# Altium schematic sheet FIT_PM12-main1.SchDoc: FIT_PM12 board
size 420 x 297 mm; CheckedBy: G.Kasprowicz; Author: INR Moscow; CompanyName: WUT ISE; DrawnBy: M.Podgórski; Organization: WUT ISE; Address1: PW ISE; Address2: Nowowiejska 15/19 00-665 Warsaw; Address3: gkasprow@gmail.com; DocumentNumber: 1; Revision: 2; SheetNumber: 1; SheetTotal: 34; ModifiedBy: -; CheckedDate: -; Title2: TOP; DivGrp: WUT ISE; Designer: INR RAS; ModifiedDate: -; ProjectName: Sensor Box
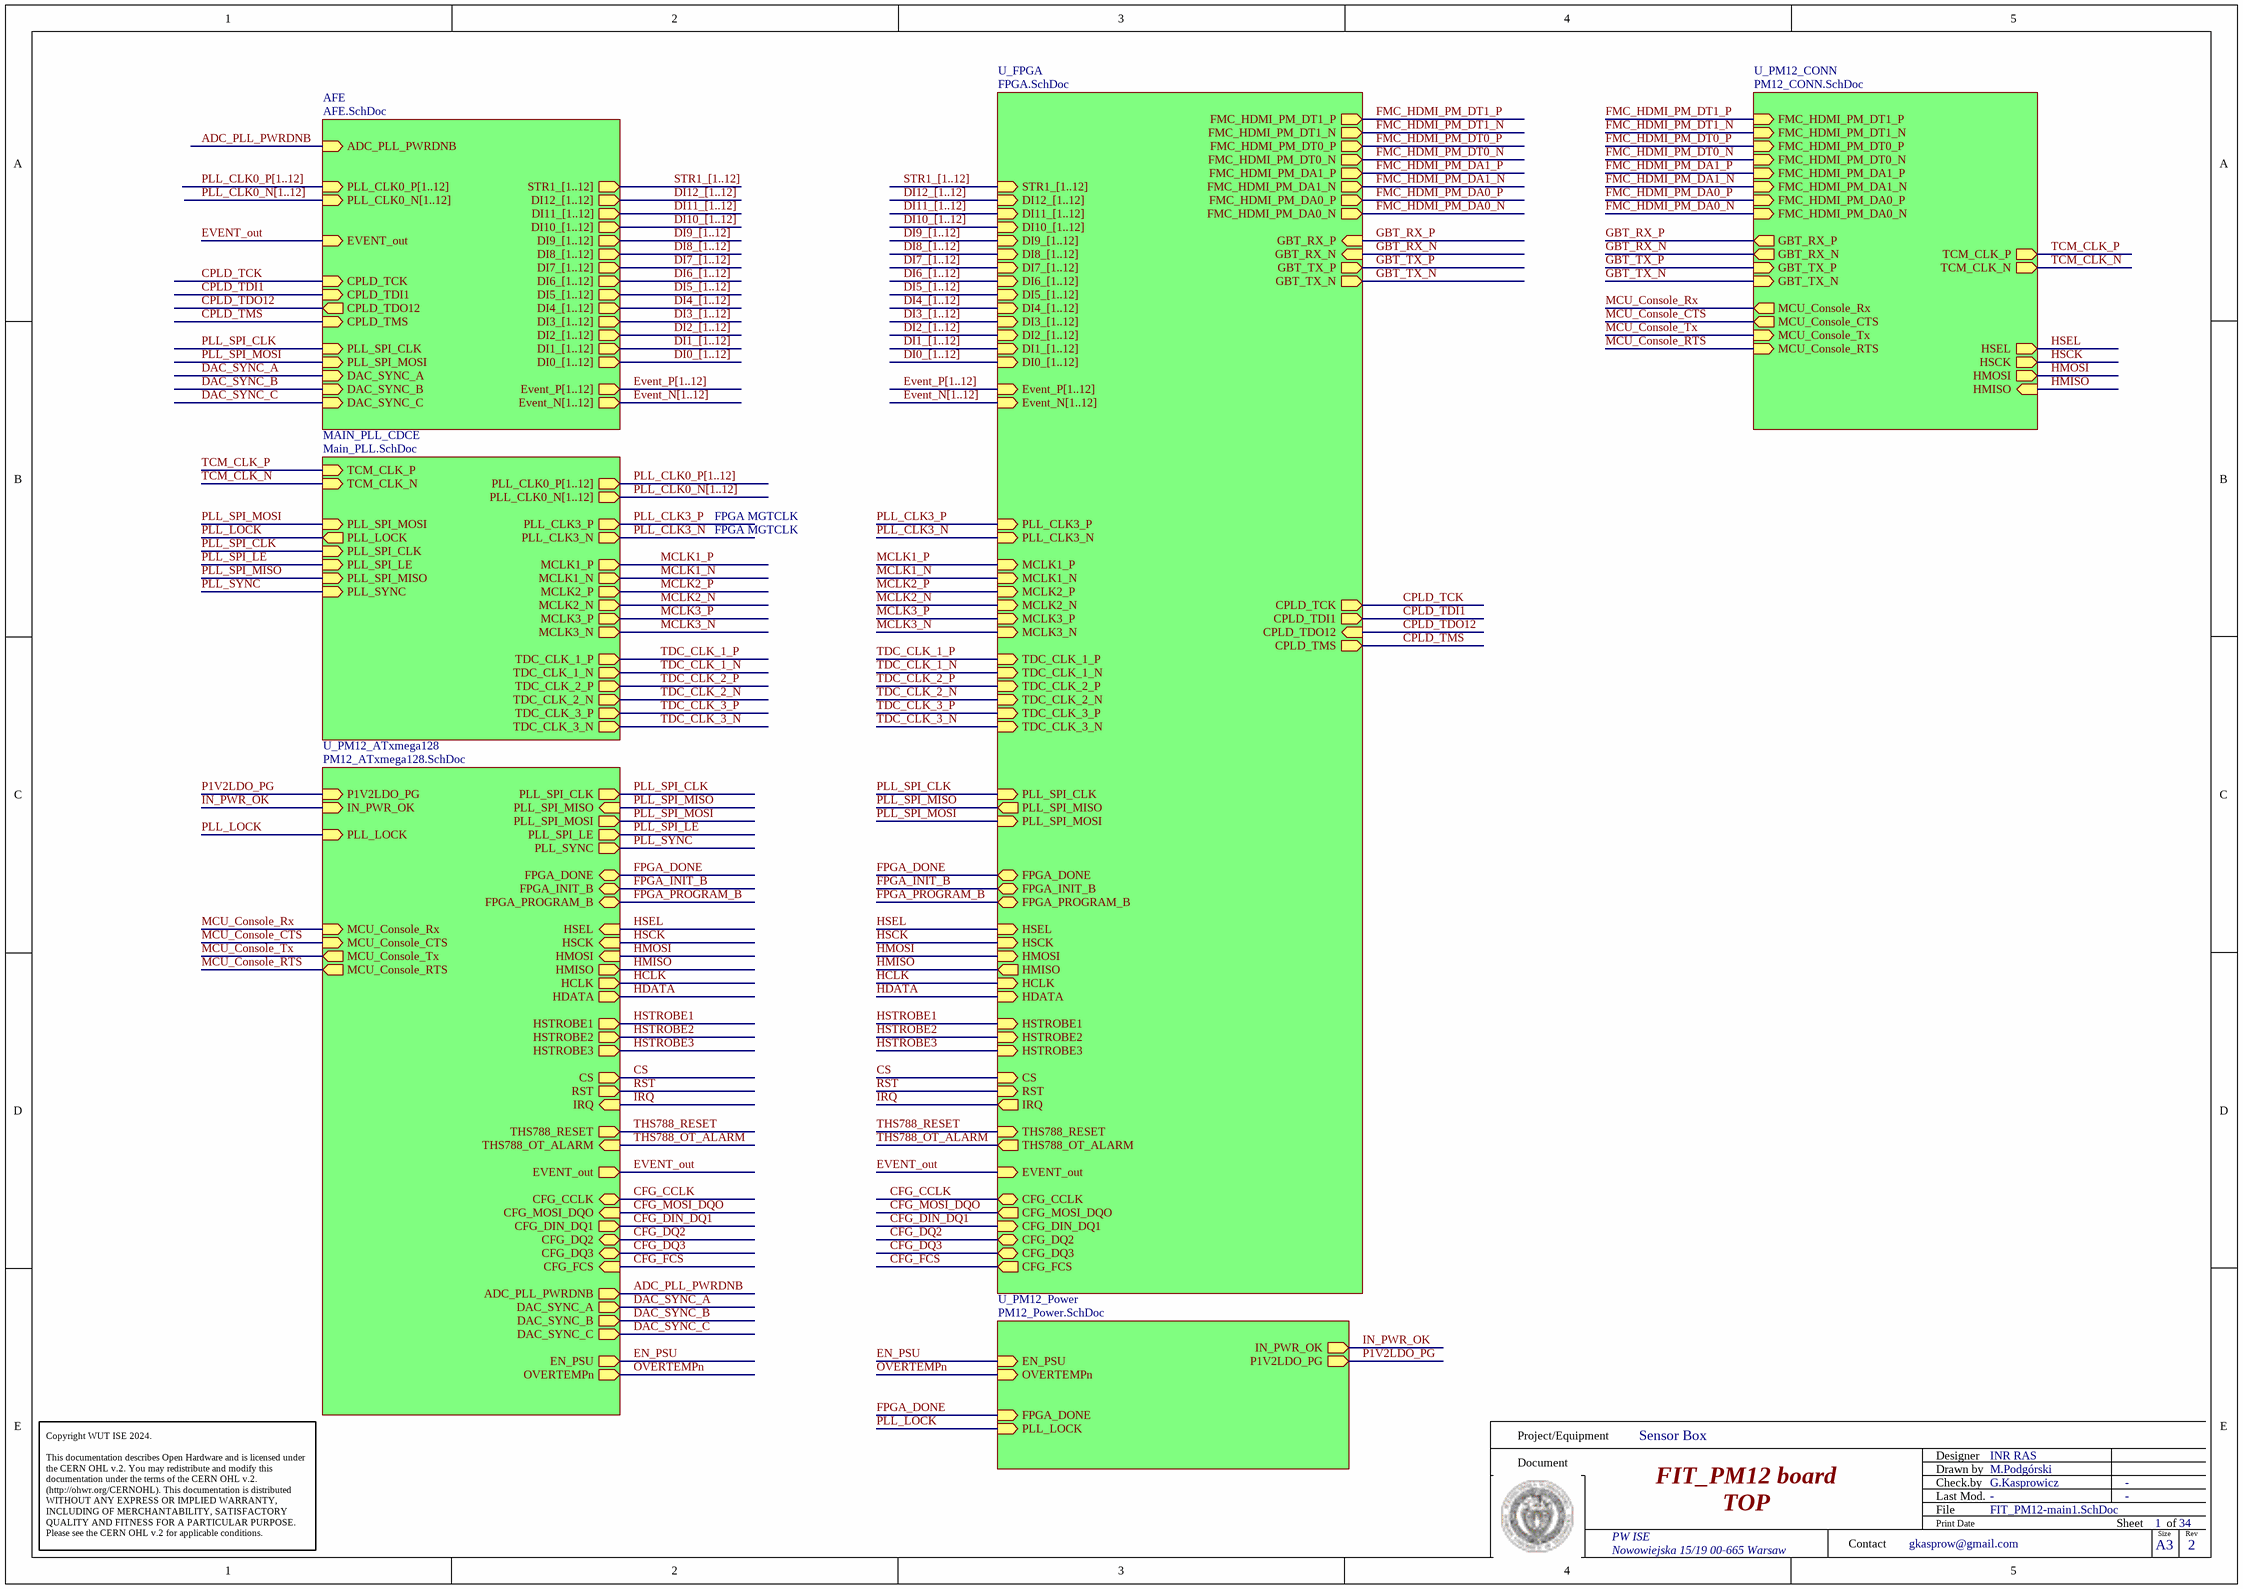
[diagram p0: FIT_PM12-main1.SchDoc]

## Sub-sheets
AFE = AFE.SchDoc: CPLD_TCK (in), CPLD_TMS (in), CPLD_TDI1 (in), CPLD_TDO12 (out), PLL_SPI_MOSI (in), DAC_SYNC_A (in), DAC_SYNC_B (in), DAC_SYNC_C (in), ADC_PLL_PWRDNB (in), EVENT_out (in), Event_P[1..12] (out), Event_N[1..12] (out), PLL_CLK0_P[1..12] (in), PLL_CLK0_N[1..12] (in), PLL_SPI_CLK (in), STR1_[1..12] (out), DI12_[1..12] (out), DI11_[1..12] (out), DI10_[1..12] (out), DI9_[1..12] (out), DI8_[1..12] (out), DI7_[1..12] (out), DI6_[1..12] (out), DI5_[1..12] (out), DI4_[1..12] (out), DI3_[1..12] (out), DI2_[1..12] (out), DI1_[1..12] (out), DI0_[1..12] (out)
MAIN_PLL_CDCE = Main_PLL.SchDoc: PLL_SPI_CLK (in), PLL_SPI_MISO (in), TCM_CLK_P (in), TCM_CLK_N (in), PLL_SYNC (in), PLL_LOCK (out), PLL_SPI_LE (in), PLL_SPI_MOSI (in), PLL_CLK3_P (out), PLL_CLK3_N (out), PLL_CLK0_P[1..12] (out), PLL_CLK0_N[1..12] (out), TDC_CLK_1_P (out), TDC_CLK_1_N (out), TDC_CLK_2_P (out), TDC_CLK_2_N (out), TDC_CLK_3_P (out), TDC_CLK_3_N (out), MCLK1_P (out), MCLK1_N (out), MCLK2_P (out), MCLK2_N (out), MCLK3_P (out), MCLK3_N (out)
U_FPGA = FPGA.SchDoc: FMC_HDMI_PM_DT1_P (out), FMC_HDMI_PM_DT1_N (out), FMC_HDMI_PM_DT0_P (out), FMC_HDMI_PM_DT0_N (out), FMC_HDMI_PM_DA1_P (out), FMC_HDMI_PM_DA1_N (out), FMC_HDMI_PM_DA0_P (out), FMC_HDMI_PM_DA0_N (out), HCLK (in), HDATA (in), HSTROBE3 (in), TDC_CLK_3_P (in), TDC_CLK_3_N (in), MCLK3_P (in), MCLK3_N (in), THS788_OT_ALARM (out), THS788_RESET (in), TDC_CLK_1_P (in), TDC_CLK_1_N (in), MCLK1_P (in), MCLK1_N (in), TDC_CLK_2_P (in), TDC_CLK_2_N (in), MCLK2_P (in), MCLK2_N (in), STR1_[1..12] (in), DI12_[1..12] (in), DI11_[1..12] (in), DI10_[1..12] (in), DI9_[1..12] (in), DI8_[1..12] (in), DI7_[1..12] (in), DI6_[1..12] (in), DI5_[1..12] (in), DI4_[1..12] (in), DI3_[1..12] (in), DI2_[1..12] (in), DI1_[1..12] (in), DI0_[1..12] (in), Event_P[1..12] (in), Event_N[1..12] (in), PLL_SPI_MOSI (in), PLL_SPI_CLK (in), PLL_SPI_MISO (out), CFG_MOSI_DQO (out), CFG_DIN_DQ1 (in), CFG_DQ2 (bidir), CFG_DQ3 (bidir), CFG_FCS (out), EVENT_out (in), HSEL (in), HSCK (in), HMOSI (in), HMISO (out), RST (in), CS (in), IRQ (out), PLL_CLK3_P (in), PLL_CLK3_N (in), GBT_RX_P (in), GBT_RX_N (in), GBT_TX_P (out), GBT_TX_N (out), CFG_CCLK (bidir), CPLD_TDO12 (in), FPGA_DONE (bidir), FPGA_INIT_B (bidir), FPGA_PROGRAM_B (bidir), CPLD_TCK (out), CPLD_TDI1 (out), CPLD_TMS (out), HSTROBE2 (in), HSTROBE1 (in)
U_PM12_ATxmega128 = PM12_ATxmega128.SchDoc: ADC_PLL_PWRDNB (out), PLL_SPI_MOSI (out), CFG_MOSI_DQO (in), CFG_DIN_DQ1 (out), CFG_DQ2 (bidir), CFG_DQ3 (bidir), CFG_FCS (in), CFG_CCLK (bidir), FPGA_DONE (bidir), FPGA_INIT_B (bidir), PLL_SPI_CLK (out), EVENT_out (out), PLL_SPI_MISO (in), CS (out), IRQ (in), RST (out), FPGA_PROGRAM_B (bidir), PLL_SYNC (out), PLL_LOCK (in), PLL_SPI_LE (out), IN_PWR_OK (in), MCU_Console_Rx (in), MCU_Console_CTS (in), MCU_Console_Tx (out), MCU_Console_RTS (out), EN_PSU (out), P1V2LDO_PG (in), THS788_RESET (out), THS788_OT_ALARM (in), OVERTEMPn (out), HSCK (in), HMISO (out), HSEL (in), HMOSI (in), HCLK (out), HDATA (out), HSTROBE1 (out), HSTROBE2 (out), HSTROBE3 (out), DAC_SYNC_A (out), DAC_SYNC_B (out), DAC_SYNC_C (out)
U_PM12_CONN = PM12_CONN.SchDoc: GBT_TX_P (in), GBT_TX_N (in), GBT_RX_P (out), GBT_RX_N (out), TCM_CLK_P (out), TCM_CLK_N (out), MCU_Console_Rx (out), MCU_Console_CTS (out), MCU_Console_Tx (in), MCU_Console_RTS (in), FMC_HDMI_PM_DT1_P (in), FMC_HDMI_PM_DT1_N (in), FMC_HDMI_PM_DT0_P (in), FMC_HDMI_PM_DT0_N (in), FMC_HDMI_PM_DA1_P (in), FMC_HDMI_PM_DA1_N (in), FMC_HDMI_PM_DA0_P (in), FMC_HDMI_PM_DA0_N (in), HSCK (out), HMISO (in), HSEL (out), HMOSI (out)
U_PM12_Power = PM12_Power.SchDoc: IN_PWR_OK (out), P1V2LDO_PG (out), EN_PSU (in), FPGA_DONE (in), OVERTEMPn (in), PLL_LOCK (in)

## Nets
ADC_PLL_PWRDNB: sheet U_PM12_ATxmega128/ADC_PLL_PWRDNB, sheet AFE/ADC_PLL_PWRDNB
CFG_CCLK: sheet U_PM12_ATxmega128/CFG_CCLK, sheet U_FPGA/CFG_CCLK
CFG_DIN_DQ1: sheet U_PM12_ATxmega128/CFG_DIN_DQ1, sheet U_FPGA/CFG_DIN_DQ1
CFG_DQ2: sheet U_PM12_ATxmega128/CFG_DQ2, sheet U_FPGA/CFG_DQ2
CFG_DQ3: sheet U_PM12_ATxmega128/CFG_DQ3, sheet U_FPGA/CFG_DQ3
CFG_FCS: sheet U_PM12_ATxmega128/CFG_FCS, sheet U_FPGA/CFG_FCS
CFG_MOSI_DQO: sheet U_PM12_ATxmega128/CFG_MOSI_DQO, sheet U_FPGA/CFG_MOSI_DQO
CPLD_TCK: sheet U_FPGA/CPLD_TCK, sheet AFE/CPLD_TCK
CPLD_TDI1: sheet U_FPGA/CPLD_TDI1, sheet AFE/CPLD_TDI1
CPLD_TDO12: sheet U_FPGA/CPLD_TDO12, sheet AFE/CPLD_TDO12
CPLD_TMS: sheet U_FPGA/CPLD_TMS, sheet AFE/CPLD_TMS
CS: sheet U_PM12_ATxmega128/CS, sheet U_FPGA/CS
DAC_SYNC_A: sheet U_PM12_ATxmega128/DAC_SYNC_A, sheet AFE/DAC_SYNC_A
DAC_SYNC_B: sheet U_PM12_ATxmega128/DAC_SYNC_B, sheet AFE/DAC_SYNC_B
DAC_SYNC_C: sheet U_PM12_ATxmega128/DAC_SYNC_C, sheet AFE/DAC_SYNC_C
EN_PSU: sheet U_PM12_ATxmega128/EN_PSU, sheet U_PM12_Power/EN_PSU
EVENT_out: sheet U_PM12_ATxmega128/EVENT_out, sheet U_FPGA/EVENT_out, sheet AFE/EVENT_out
FMC_HDMI_PM_DA0_N: sheet U_PM12_CONN/FMC_HDMI_PM_DA0_N, sheet U_FPGA/FMC_HDMI_PM_DA0_N
FMC_HDMI_PM_DA0_P: sheet U_PM12_CONN/FMC_HDMI_PM_DA0_P, sheet U_FPGA/FMC_HDMI_PM_DA0_P
FMC_HDMI_PM_DA1_N: sheet U_PM12_CONN/FMC_HDMI_PM_DA1_N, sheet U_FPGA/FMC_HDMI_PM_DA1_N
FMC_HDMI_PM_DA1_P: sheet U_PM12_CONN/FMC_HDMI_PM_DA1_P, sheet U_FPGA/FMC_HDMI_PM_DA1_P
FMC_HDMI_PM_DT0_N: sheet U_PM12_CONN/FMC_HDMI_PM_DT0_N, sheet U_FPGA/FMC_HDMI_PM_DT0_N
FMC_HDMI_PM_DT0_P: sheet U_PM12_CONN/FMC_HDMI_PM_DT0_P, sheet U_FPGA/FMC_HDMI_PM_DT0_P
FMC_HDMI_PM_DT1_N: sheet U_PM12_CONN/FMC_HDMI_PM_DT1_N, sheet U_FPGA/FMC_HDMI_PM_DT1_N
FMC_HDMI_PM_DT1_P: sheet U_PM12_CONN/FMC_HDMI_PM_DT1_P, sheet U_FPGA/FMC_HDMI_PM_DT1_P
FPGA_DONE: sheet U_PM12_ATxmega128/FPGA_DONE, sheet U_PM12_Power/FPGA_DONE, sheet U_FPGA/FPGA_DONE
FPGA_INIT_B: sheet U_PM12_ATxmega128/FPGA_INIT_B, sheet U_FPGA/FPGA_INIT_B
FPGA_PROGRAM_B: sheet U_PM12_ATxmega128/FPGA_PROGRAM_B, sheet U_FPGA/FPGA_PROGRAM_B
GBT_RX_N: sheet U_PM12_CONN/GBT_RX_N, sheet U_FPGA/GBT_RX_N
GBT_RX_P: sheet U_PM12_CONN/GBT_RX_P, sheet U_FPGA/GBT_RX_P
GBT_TX_N: sheet U_PM12_CONN/GBT_TX_N, sheet U_FPGA/GBT_TX_N
GBT_TX_P: sheet U_PM12_CONN/GBT_TX_P, sheet U_FPGA/GBT_TX_P
HCLK: sheet U_PM12_ATxmega128/HCLK, sheet U_FPGA/HCLK
HDATA: sheet U_PM12_ATxmega128/HDATA, sheet U_FPGA/HDATA
HMISO: sheet U_PM12_CONN/HMISO, sheet U_PM12_ATxmega128/HMISO, sheet U_FPGA/HMISO
HMOSI: sheet U_PM12_CONN/HMOSI, sheet U_PM12_ATxmega128/HMOSI, sheet U_FPGA/HMOSI
HSCK: sheet U_PM12_CONN/HSCK, sheet U_PM12_ATxmega128/HSCK, sheet U_FPGA/HSCK
HSEL: sheet U_PM12_CONN/HSEL, sheet U_PM12_ATxmega128/HSEL, sheet U_FPGA/HSEL
HSTROBE1: sheet U_PM12_ATxmega128/HSTROBE1, sheet U_FPGA/HSTROBE1
HSTROBE2: sheet U_PM12_ATxmega128/HSTROBE2, sheet U_FPGA/HSTROBE2
HSTROBE3: sheet U_PM12_ATxmega128/HSTROBE3, sheet U_FPGA/HSTROBE3
IN_PWR_OK: sheet U_PM12_ATxmega128/IN_PWR_OK, sheet U_PM12_Power/IN_PWR_OK
IRQ: sheet U_PM12_ATxmega128/IRQ, sheet U_FPGA/IRQ
MCLK1_N: sheet MAIN_PLL_CDCE/MCLK1_N, sheet U_FPGA/MCLK1_N
MCLK1_P: sheet MAIN_PLL_CDCE/MCLK1_P, sheet U_FPGA/MCLK1_P
MCLK2_N: sheet MAIN_PLL_CDCE/MCLK2_N, sheet U_FPGA/MCLK2_N
MCLK2_P: sheet MAIN_PLL_CDCE/MCLK2_P, sheet U_FPGA/MCLK2_P
MCLK3_N: sheet MAIN_PLL_CDCE/MCLK3_N, sheet U_FPGA/MCLK3_N
MCLK3_P: sheet MAIN_PLL_CDCE/MCLK3_P, sheet U_FPGA/MCLK3_P
MCU_Console_CTS: sheet U_PM12_CONN/MCU_Console_CTS, sheet U_PM12_ATxmega128/MCU_Console_CTS
MCU_Console_RTS: sheet U_PM12_CONN/MCU_Console_RTS, sheet U_PM12_ATxmega128/MCU_Console_RTS
MCU_Console_Rx: sheet U_PM12_CONN/MCU_Console_Rx, sheet U_PM12_ATxmega128/MCU_Console_Rx
MCU_Console_Tx: sheet U_PM12_CONN/MCU_Console_Tx, sheet U_PM12_ATxmega128/MCU_Console_Tx
OVERTEMPn: sheet U_PM12_ATxmega128/OVERTEMPn, sheet U_PM12_Power/OVERTEMPn
P1V2LDO_PG: sheet U_PM12_ATxmega128/P1V2LDO_PG, sheet U_PM12_Power/P1V2LDO_PG
PLL_CLK3_N: sheet MAIN_PLL_CDCE/PLL_CLK3_N, sheet U_FPGA/PLL_CLK3_N
PLL_CLK3_P: sheet MAIN_PLL_CDCE/PLL_CLK3_P, sheet U_FPGA/PLL_CLK3_P
PLL_LOCK: sheet MAIN_PLL_CDCE/PLL_LOCK, sheet U_PM12_ATxmega128/PLL_LOCK, sheet U_PM12_Power/PLL_LOCK
PLL_SPI_CLK: sheet MAIN_PLL_CDCE/PLL_SPI_CLK, sheet U_PM12_ATxmega128/PLL_SPI_CLK, sheet U_FPGA/PLL_SPI_CLK, sheet AFE/PLL_SPI_CLK
PLL_SPI_LE: sheet MAIN_PLL_CDCE/PLL_SPI_LE, sheet U_PM12_ATxmega128/PLL_SPI_LE
PLL_SPI_MISO: sheet MAIN_PLL_CDCE/PLL_SPI_MISO, sheet U_PM12_ATxmega128/PLL_SPI_MISO, sheet U_FPGA/PLL_SPI_MISO
PLL_SPI_MOSI: sheet MAIN_PLL_CDCE/PLL_SPI_MOSI, sheet U_PM12_ATxmega128/PLL_SPI_MOSI, sheet U_FPGA/PLL_SPI_MOSI, sheet AFE/PLL_SPI_MOSI
PLL_SYNC: sheet MAIN_PLL_CDCE/PLL_SYNC, sheet U_PM12_ATxmega128/PLL_SYNC
RST: sheet U_PM12_ATxmega128/RST, sheet U_FPGA/RST
TCM_CLK_N: sheet MAIN_PLL_CDCE/TCM_CLK_N, sheet U_PM12_CONN/TCM_CLK_N
TCM_CLK_P: sheet MAIN_PLL_CDCE/TCM_CLK_P, sheet U_PM12_CONN/TCM_CLK_P
TDC_CLK_1_N: sheet MAIN_PLL_CDCE/TDC_CLK_1_N, sheet U_FPGA/TDC_CLK_1_N
TDC_CLK_1_P: sheet MAIN_PLL_CDCE/TDC_CLK_1_P, sheet U_FPGA/TDC_CLK_1_P
TDC_CLK_2_N: sheet MAIN_PLL_CDCE/TDC_CLK_2_N, sheet U_FPGA/TDC_CLK_2_N
TDC_CLK_2_P: sheet MAIN_PLL_CDCE/TDC_CLK_2_P, sheet U_FPGA/TDC_CLK_2_P
TDC_CLK_3_N: sheet MAIN_PLL_CDCE/TDC_CLK_3_N, sheet U_FPGA/TDC_CLK_3_N
TDC_CLK_3_P: sheet MAIN_PLL_CDCE/TDC_CLK_3_P, sheet U_FPGA/TDC_CLK_3_P
THS788_OT_ALARM: sheet U_PM12_ATxmega128/THS788_OT_ALARM, sheet U_FPGA/THS788_OT_ALARM
THS788_RESET: sheet U_PM12_ATxmega128/THS788_RESET, sheet U_FPGA/THS788_RESET

## Buses and harness runs
bus DI0_[1..12] = sheet AFE/DI0_[1..12]
bus DI0_[1..12] = sheet U_FPGA/DI0_[1..12]
bus DI1_[1..12] = sheet AFE/DI1_[1..12]
bus DI1_[1..12] = sheet U_FPGA/DI1_[1..12]
bus DI2_[1..12] = sheet AFE/DI2_[1..12]
bus DI2_[1..12] = sheet U_FPGA/DI2_[1..12]
bus DI3_[1..12] = sheet AFE/DI3_[1..12]
bus DI3_[1..12] = sheet U_FPGA/DI3_[1..12]
bus DI4_[1..12] = sheet AFE/DI4_[1..12]
bus DI4_[1..12] = sheet U_FPGA/DI4_[1..12]
bus DI5_[1..12] = sheet AFE/DI5_[1..12]
bus DI5_[1..12] = sheet U_FPGA/DI5_[1..12]
bus DI6_[1..12] = sheet AFE/DI6_[1..12]
bus DI6_[1..12] = sheet U_FPGA/DI6_[1..12]
bus DI7_[1..12] = sheet AFE/DI7_[1..12]
bus DI7_[1..12] = sheet U_FPGA/DI7_[1..12]
bus DI8_[1..12] = sheet AFE/DI8_[1..12]
bus DI8_[1..12] = sheet U_FPGA/DI8_[1..12]
bus DI9_[1..12] = sheet AFE/DI9_[1..12]
bus DI9_[1..12] = sheet U_FPGA/DI9_[1..12]
bus DI10_[1..12] = sheet AFE/DI10_[1..12]
bus DI10_[1..12] = sheet U_FPGA/DI10_[1..12]
bus DI11_[1..12] = sheet AFE/DI11_[1..12]
bus DI11_[1..12] = sheet U_FPGA/DI11_[1..12]
bus DI12_[1..12] = sheet AFE/DI12_[1..12]
bus DI12_[1..12] = sheet U_FPGA/DI12_[1..12]
bus Event_N[1..12] = sheet AFE/Event_N[1..12]
bus Event_N[1..12] = sheet U_FPGA/Event_N[1..12]
bus Event_P[1..12] = sheet AFE/Event_P[1..12]
bus Event_P[1..12] = sheet U_FPGA/Event_P[1..12]
bus PLL_CLK0_N[1..12] = sheet AFE/PLL_CLK0_N[1..12]
bus PLL_CLK0_N[1..12] = sheet MAIN_PLL_CDCE/PLL_CLK0_N[1..12]
bus PLL_CLK0_P[1..12] = sheet AFE/PLL_CLK0_P[1..12]
bus PLL_CLK0_P[1..12] = sheet MAIN_PLL_CDCE/PLL_CLK0_P[1..12]
bus STR1_[1..12] = sheet AFE/STR1_[1..12]
bus STR1_[1..12] = sheet U_FPGA/STR1_[1..12]

## Notes on the sheet
- FPGA MGTCLK
- Project/Equipment
- Document
- Designer
- Drawn by
- Check.by
- Copyright WUT ISE 2024.
  This documentation describes Open Hardware and is licensed under the CERN OHL v.2. You may redistribute and modify this documentation under the terms of the CERN OHL v.2. (http://ohwr.org/CERNOHL). This documentation is distributed WITHOUT ANY EXPRESS OR IMPLIED WARRANTY, INCLUDING OF MERCHANTABILITY, SATISFACTORY QUALITY AND FITNESS FOR A PARTICULAR PURPOSE. Please see the CERN OHL v.2 for applicable conditions.
- Contact
- File
- Last Mod.
- Print Date
- Sheet
- Size
- A3
- of
- Rev